# EasyEDA schematic SCH_Moisture Sensorv1_2022-10-20.json
TITLE: Sheet_1; REV: 1.0; Date: 2022-02-08; Sheet: 1/1; Drawn By: Paul Moeller; Company: Your Company
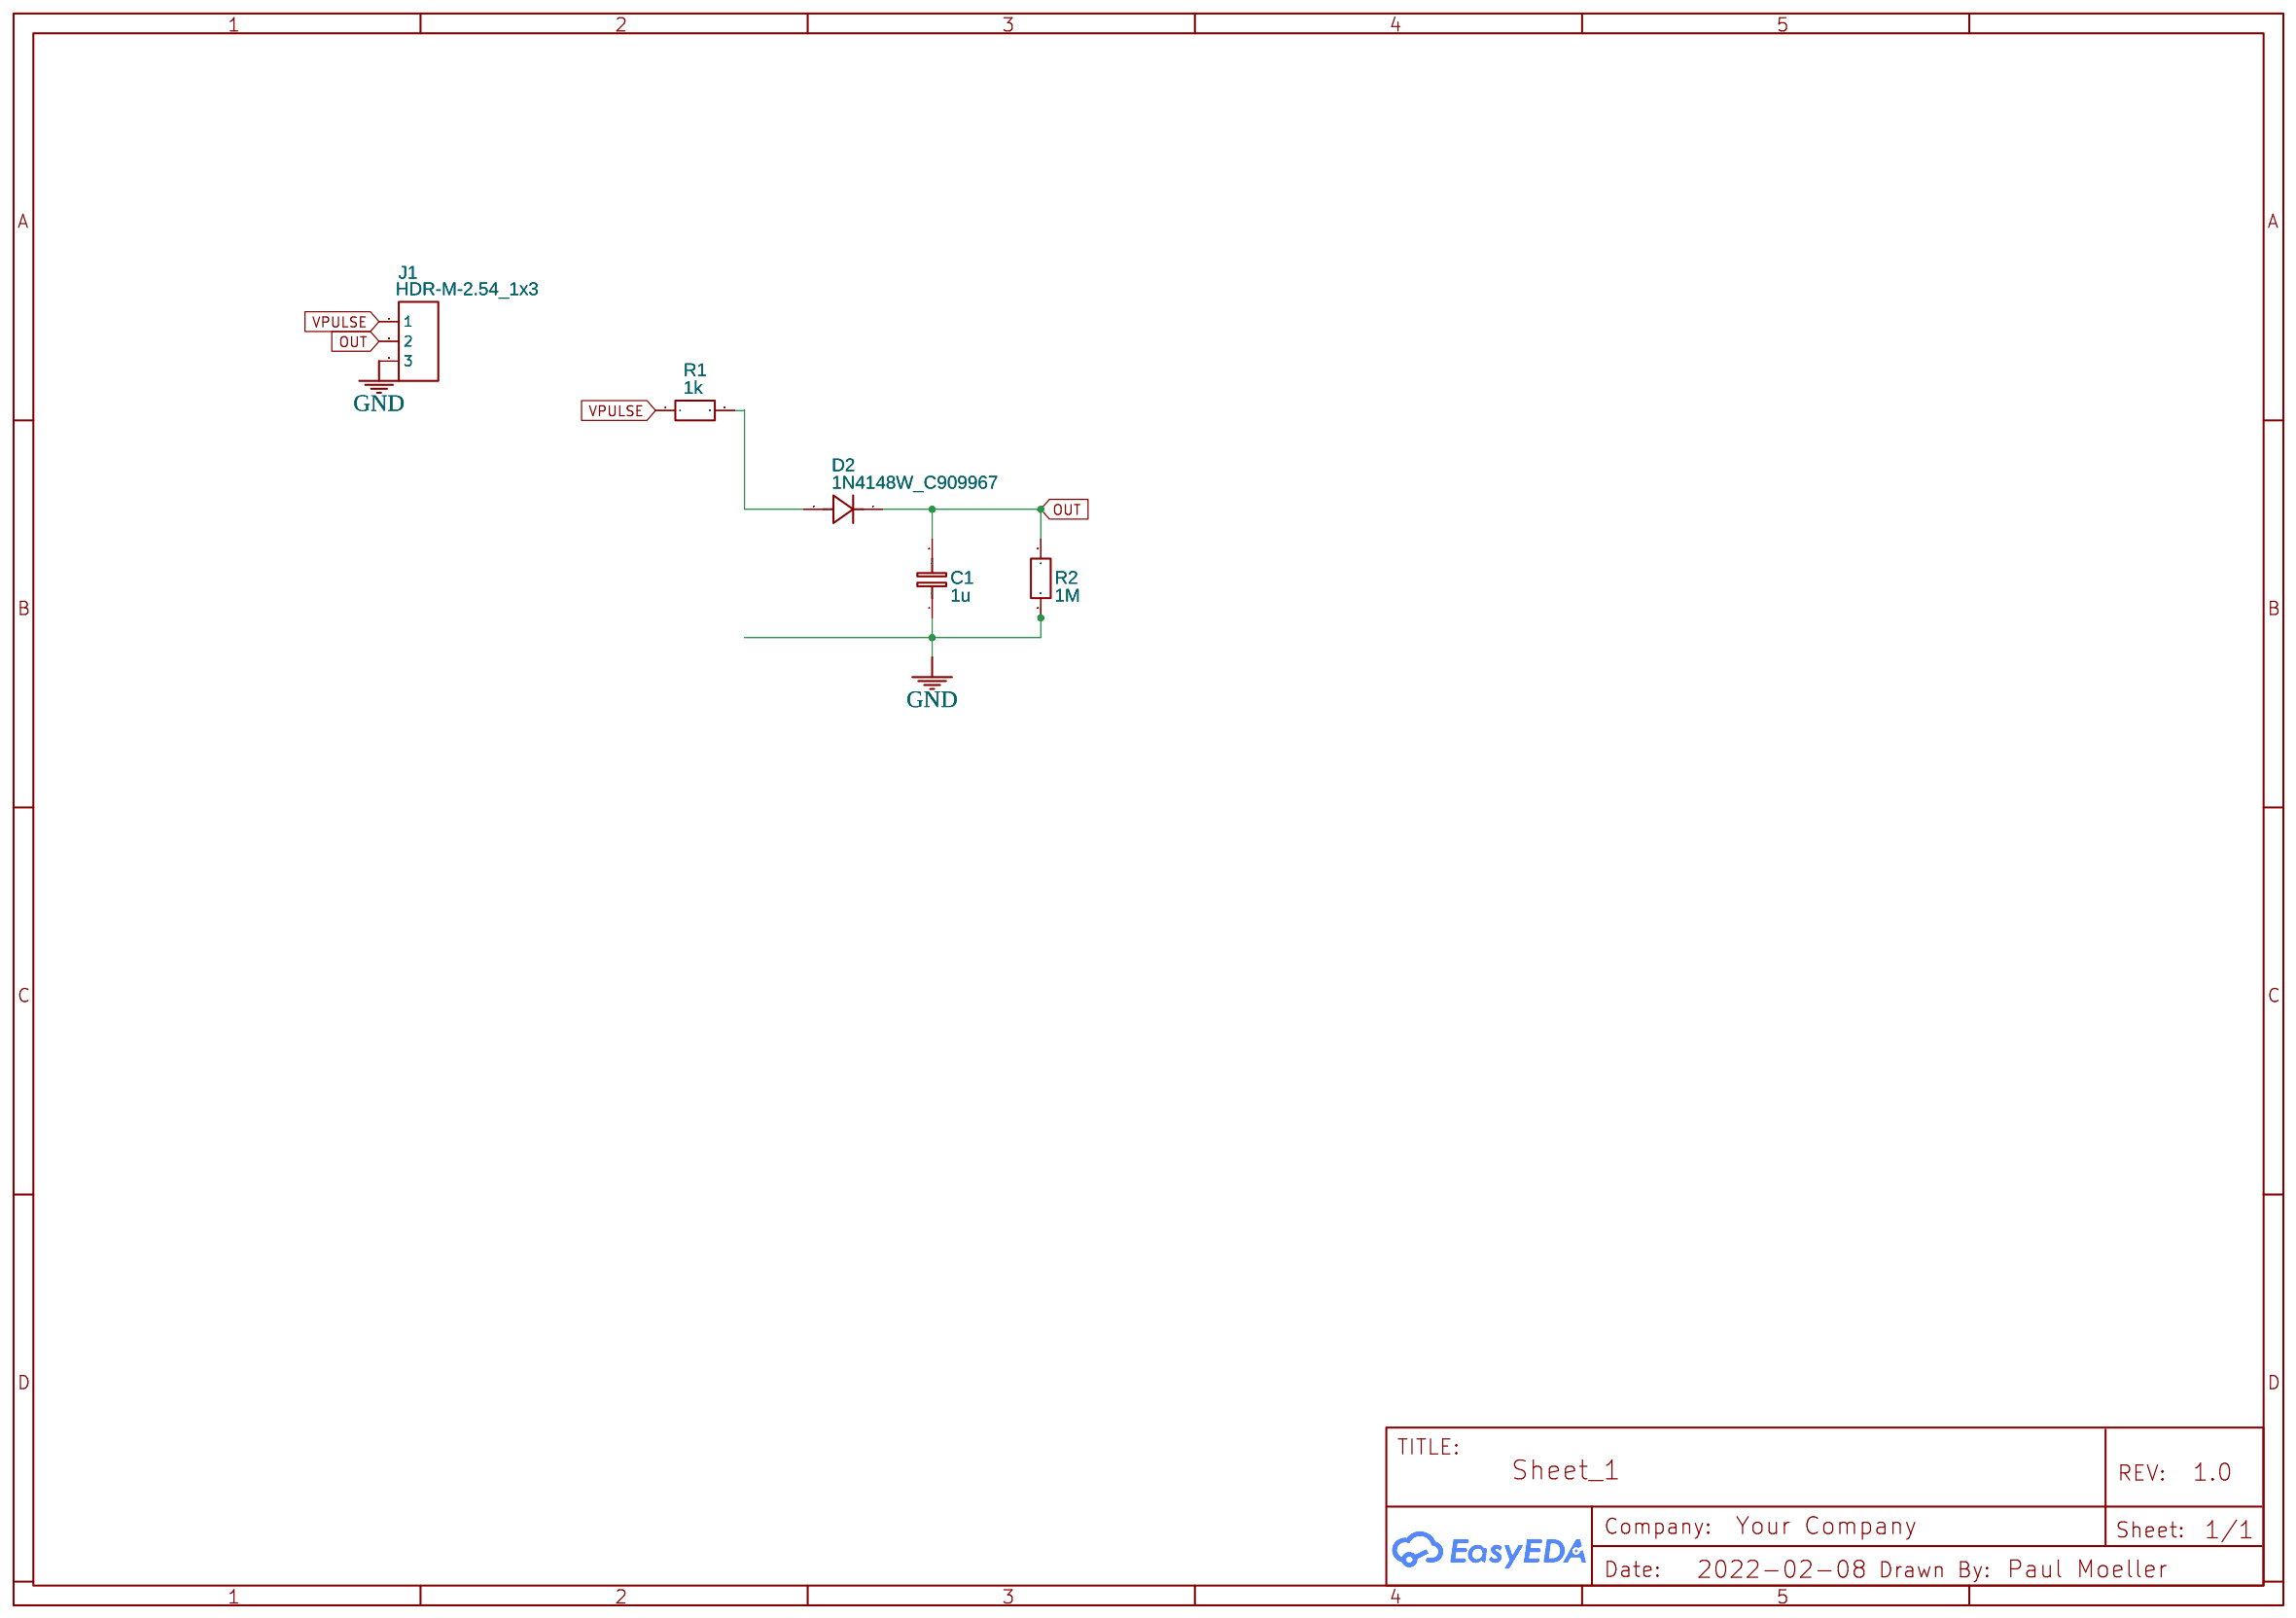
[diagram p0: schematic sheet]

## Parts
C1  1u  [C0805]
D2  1N4148W_C909967  [SOD-123_L2.7-W1.6-LS3.8-RD]
J1  HDR-M-2.54_1x3  [HDR-M-2.54_1X3]
R1  1k  [R0805]
R2  1M  [R0805]

## Library data of the parts
C1 = C_0805_EU: Contributor: LCEDA_Lib
D2 = 1N4148W_C909967: Supplier: LCSC; Supplier Part: C909967; Manufacturer: GOODWORK; Manufacturer Part: 1N4148W; Contributor: LCSC; JLCPCB Part Class: Extended Part
J1 = HDR-M-2.54_1x3: Supplier Part: C180248; Supplier: LCSC; Contributor: LCEDA_Lib
R1 R2 = R_0805_EU: Contributor: LCEDA_Lib

## Nets
GND: C1.1 J1.3 R2.1
OUT: C1.2 D2.1(K) J1.2 R2.2
VPULSE: J1.1 R1.1
Net-(D2-2): D2.2(A) R1.2
